# Altium project DC2342A-4.PrjPcb
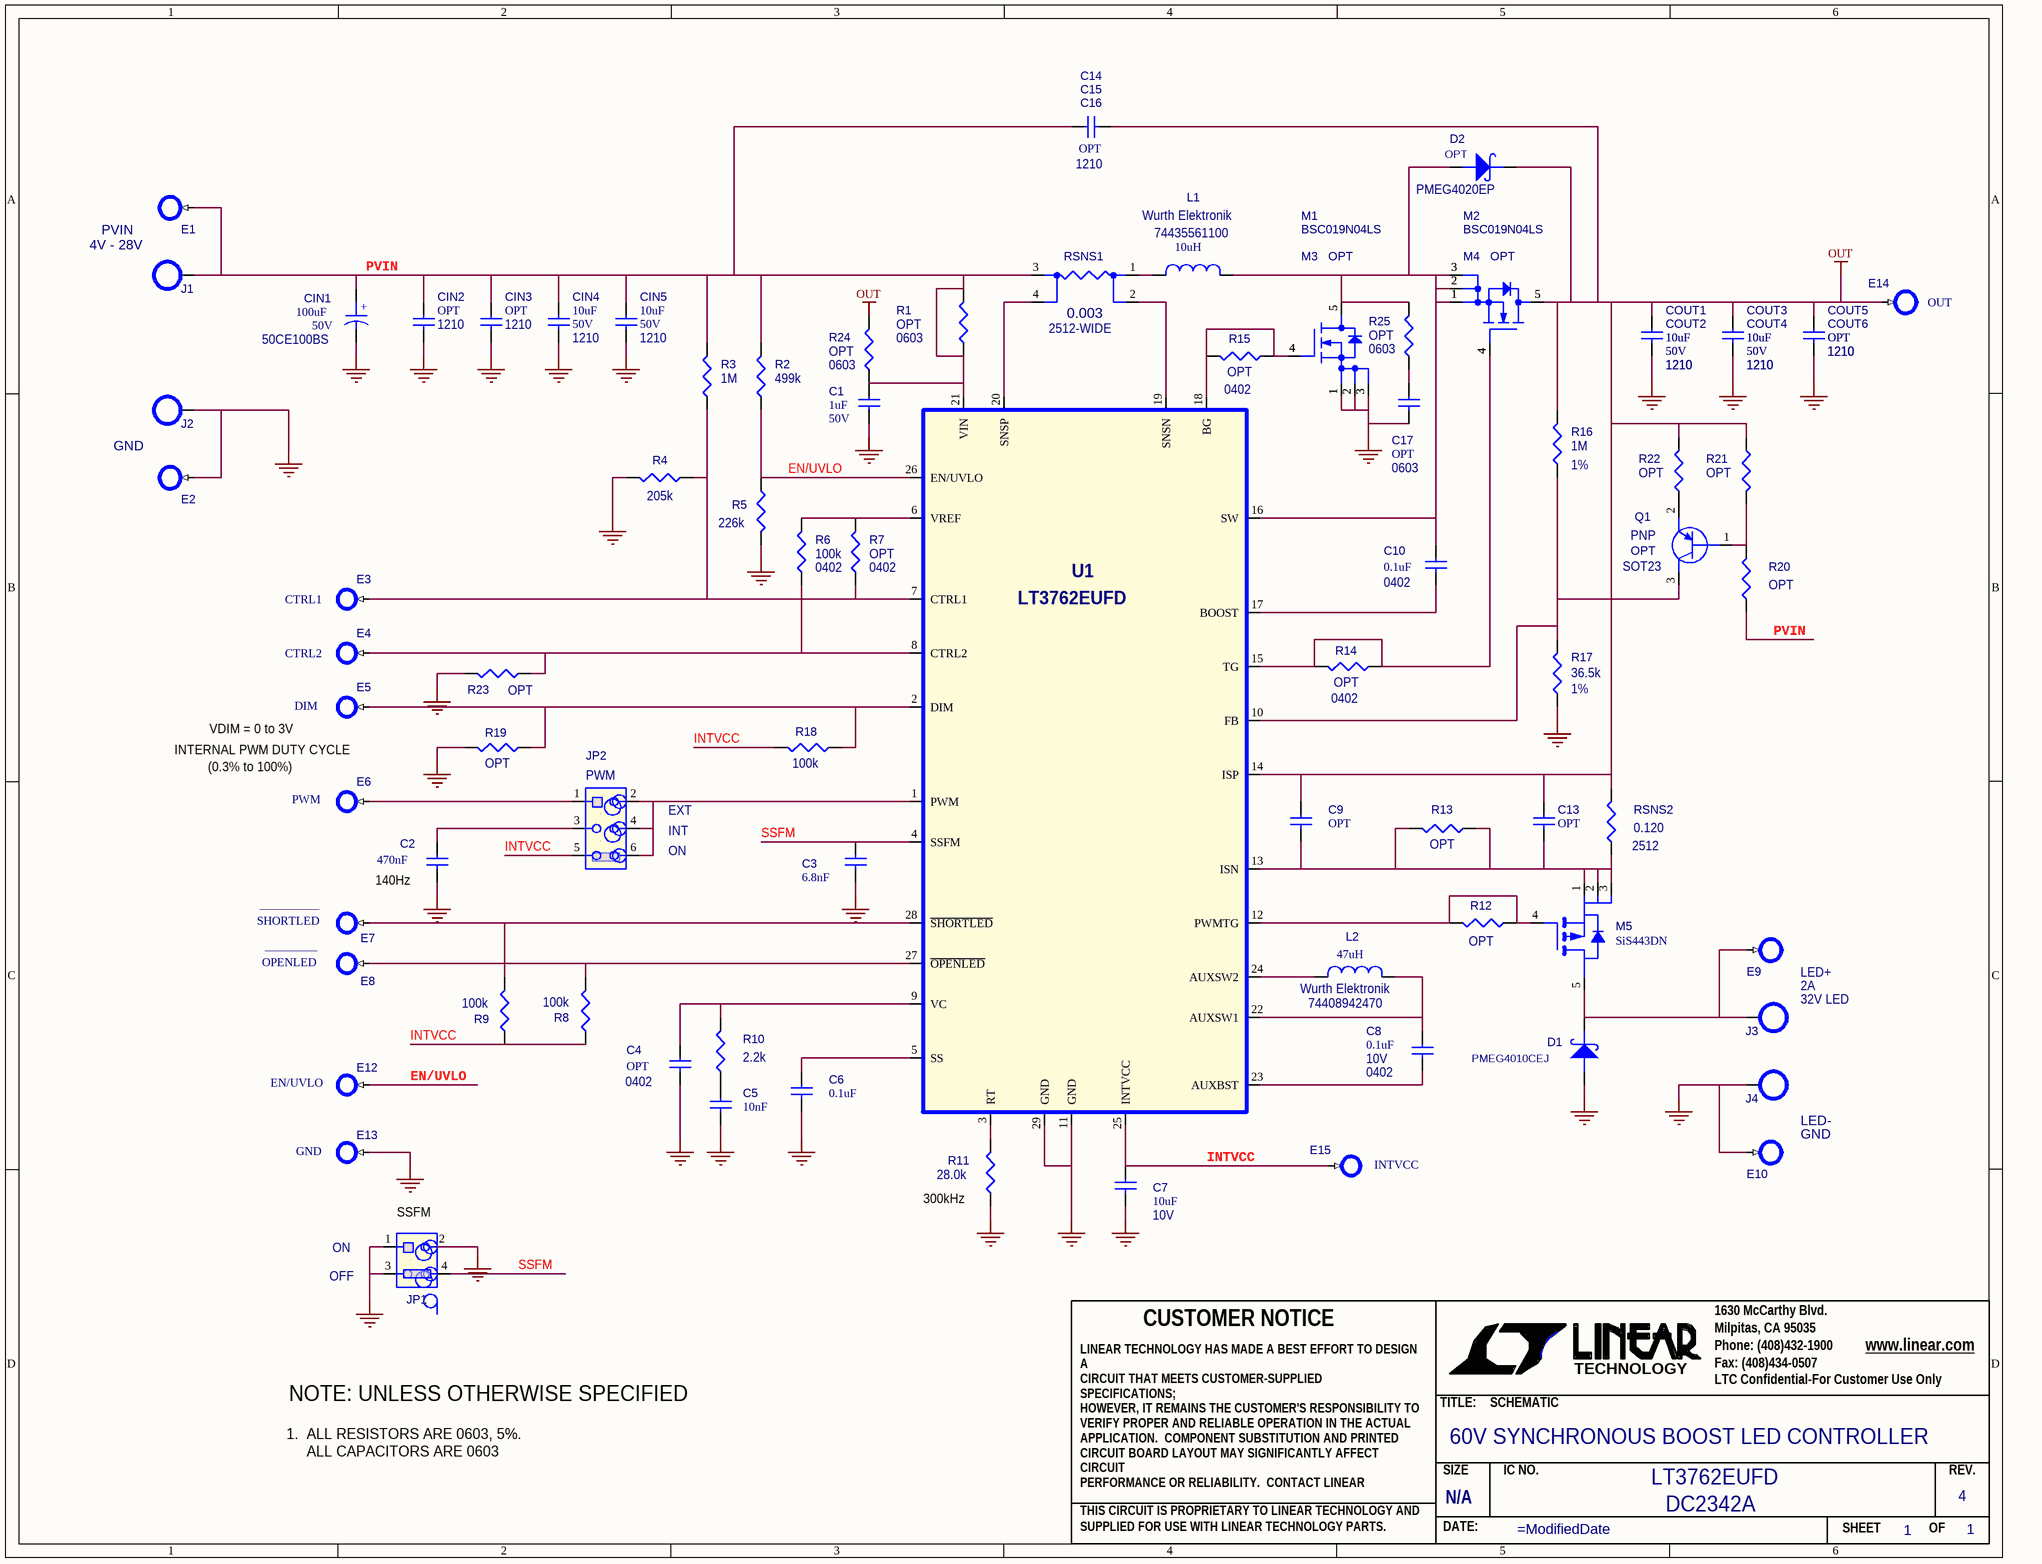
[diagram p0: LT3762EUFD.SchDoc]
1 sheet, 87 parts. Net scope: global (net labels, ports and power ports of the same name join across sheets).

## Sheet LT3762EUFD.SchDoc: 60V SYNCHRONOUS BOOST LED CONTROLLER
size 375 x 292 mm; Date: <DATE>; DATE1: <DATE>; PCB DESIGNER: KIM T.; ECO: 1; Drawn: KIM T.; Page Number: 1; Cage Code: WITH PROGRAMMABLE CURRENT LIMIT; FAB: 1ST PROTOTYPE; APP. ENG.: TIGER Z.; Comment: TITLEBLK-SMALL; Page Count: 1; SIZE: N/A; RevCode: 4; DWG NAME: LT3762EUFD; Doc: DC2342A; DsnPath: D:\Projects\LT3762_Board\DC2342A\DC2342A-4.DSN; SchematicName: DC2342A-4; PageName: LT3762EUFD; PageSize: Custom; TopSchematic: True

### Parts
*  Page Count: 1  Doc: DC2342A  Title: 60V SYNCHRONOUS BOOST LED CONTROLLER  RevCode: 4  DWG NAME: LT3762EUFD  (hidden comment: TITLEBLK-SMALL)  (graphical)
C1  1uF  1st Part Field: 50V  [1206]
C2  470nF  [1206]
C3  6.8nF  [1206]
C4  OPT  PCB Footprint: 0402  [1206]
C5  10nF  [1206]
C6  0.1uF  [1206]
C7  10uF  1st Part Field: 10V  [1206]
C8  0.1uF  1st Part Field: 10V  PCB Footprint: 0402  [1206]
C9  OPT  [1206]
C10  0.1uF  PCB Footprint: 0402  [1206]
C13  OPT  [1206]
C14  OPT  PCB Footprint: 1210  [1206]
C15  OPT  [1206]  (value not drawn)
C16  OPT  [1206]  (value not drawn)
C17  OPT  PCB Footprint: 0603  [1206]
CIN1  100uF  1st Part Field: 50V  5th Part Field: 50CE100BS  [7343\POSCAP]
CIN2  OPT  PCB Footprint: 1210  [1206]
CIN3  OPT  PCB Footprint: 1210  [1206]
CIN4  10uF  1st Part Field: 50V  PCB Footprint: 1210  [1206]
CIN5  10uF  1st Part Field: 50V  PCB Footprint: 1210  [1206]
COUT1  10uF  1st Part Field: 50V  PCB Footprint: 1210  [1206]
COUT2  10uF  1st Part Field: 50V  PCB Footprint: 1210  [1206]
COUT3  10uF  1st Part Field: 50V  PCB Footprint: 1210  [1206]
COUT4  10uF  1st Part Field: 50V  PCB Footprint: 1210  [1206]
COUT5  OPT  PCB Footprint: 1210  [1206]
COUT6  OPT  PCB Footprint: 1210  [1206]
D1  PMEG4010CEJ  [SOD-123]
D2  OPT  5th Part Field: PMEG4020EP  [SOD-123]
E1  Testpoint  [MM/2501]  (value not drawn)
E2  Testpoint  [MM/2501]  (value not drawn)
E3  9th Part Field: CTRL1  [MM/2501]  (hidden comment: Testpoint)
E4  9th Part Field: CTRL2  [MM/2501]  (hidden comment: Testpoint)
E5  9th Part Field: DIM  [MM/2501]  (hidden comment: Testpoint)
E6  9th Part Field: PWM  [MM/2501]  (hidden comment: Testpoint)
E7  10th Part Field: ________  9th Part Field: SHORTLED  [MM/2501]  (hidden comment: Testpoint)
E8  10th Part Field: _______  9th Part Field: OPENLED  [MM/2501]  (hidden comment: Testpoint)
E9  Testpoint  [MM/2501]  (value not drawn)
E10  Testpoint  [MM/2501]  (value not drawn)
E12  9th Part Field: EN/UVLO  [MM/2501]  (hidden comment: Testpoint)
E13  9th Part Field: GND  [MM/2501]  (hidden comment: Testpoint)
E14  9th Part Field: OUT  [MM/2501]  (hidden comment: Testpoint)
E15  9th Part Field: INTVCC  [MM/2501]  (hidden comment: Testpoint)
J1  8th Part Field: 4V - 28V  9th Part Field: PVIN  [KEY-575-4]  (hidden comment: BANANA-JACK)
J2  9th Part Field: GND  [KEY-575-4]  (hidden comment: BANANA-JACK)
J3  9th Part Field: 2A  8th Part Field: LED+  10th Part Field: 32V LED  [KEY-575-4]  (hidden comment: BANANA-JACK)
J4  9th Part Field: LED-  8th Part Field: GND  [KEY-575-4]  (hidden comment: BANANA-JACK)
JP1  9th Part Field: ON  10th Part Field: OFF  [JP2X2/079]  (hidden comment: JP2X2/079)
JP2  9th Part Field: PWM  10th Part Field: ON  13tht Part Field: EXT  11th Part Field: INT  [JP2X3/079]  (hidden comment: JP2X3/079)
L1  10uH  5TH PART FIELD: 74435561100  4TH PART FIELD: Wurth Elektronik  [IND-7443557]
L2  47uH  5TH PART FIELD: 74408942470  4TH PART FIELD: Wurth Elektronik  [IND-7440894]
M1  BSC019N04LS  [PG-TDSON-8]
M2  BSC019N04LS  [PG-TDSON-8]
M3  OPT  [PG-TDSON-8]
M4  OPT  [PG-TDSON-8]
M5  SiS443DN  [SO-08]
Q1  OPT  5TH PART FIELD: PNP  [SOT23]
R1  OPT  PCB Footprint: 0603  [0402]
R2  499k  [0402]
R3  1M  [0402]
R4  205k  [0402]
R5  226k  [0402]
R6  100k  [0402]
R7  OPT  [0402]
R8  100k  [0402]
R9  100k  [0402]
R10  2.2k  [0402]
R11  28.0k  [0402]
R12  OPT  [0402]
R13  OPT  [0402]
R14  OPT  [0402]
R15  OPT  [0402]
R16  1M  6th Part Field: 1%  [0402]
R17  36.5k  6th Part Field: 1%  [0402]
R18  100k  [0402]
R19  OPT  [0402]
R20  OPT  [0402]
R21  OPT  [0402]
R22  OPT  [0402]
R23  OPT  [0402]
R24  OPT  PCB Footprint: 0603  [0402]
R25  OPT  PCB Footprint: 0603  [0402]
RSNS1  0.003  FOOTPRINT: 2512-WIDE  [1206-SENSE]
RSNS2  0.120  PCB Footprint: 2512  [0402]
U1  LT3762EUFD  [QFN-28-4X5]
XJP1  2mm Ctrs.  (value not drawn)
XJP2  2mm Ctrs.  (value not drawn)

### Nets
GND: C1.2 C2.2 C3.2 C4.2 C5.2 C6.2 C7.2 C17.2 CIN1.2 CIN2.2 CIN3.2 CIN4.2 CIN5.2 COUT1.2 COUT2.2 COUT3.2 COUT4.2 COUT5.2 COUT6.2 D1.2 E2.1 E10.1 E13.1 J2.1 J4.1 JP1.1 JP1.2 JP1.3 M1.1(SOURCE) M1.2(SOURCE) M1.3(SOURCE) M3.1(SOURCE) M3.2(SOURCE) M3.3(SOURCE) R4.2 R5.1 R11.1 R17.1 R19.1 R23.1 U1.11(GND) U1.29(GND)
OUT: C9.1 C13.1 C14.2 C15.2 C16.2 COUT1.1 COUT2.1 COUT3.1 COUT4.1 COUT5.1 COUT6.1 D2.1 E14.1 M2.5(DRAIN) M4.5(DRAIN) R16.2 R21.1 R22.2 R24.2 RSNS2.2 U1.14(ISP)
EN/UVLO: E12.1 R2.1 R5.2 U1.26(EN/UVLO)
INTVCC: C7.1 E15.1 JP2.5 R8.2 R9.2 R18.1 U1.25(INTVCC)
PVIN: C1.1 C14.1 C15.1 C16.1 CIN1.1 CIN2.1 CIN3.1 CIN4.1 CIN5.1 E1.1 J1.1 R1.1 R1.2 R2.2 R3.2 R20.1 R24.1 RSNS1.3 U1.21(VIN)
SSFM: C3.1 JP1.4 U1.4(SSFM)
NetC2_1: C2.1 JP2.3
NetC4_1: C4.1 R10.2 U1.9(VC)
NetC5_1: C5.1 R10.1
NetC6_1: C6.1 U1.5(SS)
NetC8_1: C8.1 L2.2 U1.22(AUXSW1)
NetC8_2: C8.2 U1.23(AUXBST)
NetC9_2: C9.2 C13.2 M5.1 M5.2 M5.3 R13.1 R13.2 RSNS2.1 U1.13(ISN)
NetC10_1: C10.1 D2.2 L1.2 M1.5(DRAIN) M2.1(SOURCE) M2.2(SOURCE) M2.3(SOURCE) M3.5(DRAIN) M4.1(SOURCE) M4.2(SOURCE) M4.3(SOURCE) R25.2 U1.16(SW)
NetC10_2: C10.2 U1.17(BOOST)
NetC17_1: C17.1 R25.1
NetD1_1: D1.1 E9.1 J3.1 M5.5
NetE3_1: E3.1 R3.1 R4.1 R7.1 U1.7(CTRL1)
NetE4_1: E4.1 R6.1 R23.2 U1.8(CTRL2)
NetE5_1: E5.1 R18.2 R19.2 U1.2(DIM)
NetE6_1: E6.1 JP2.1
NetE7_1: E7.1 R9.1 U1.28(~{SHORTLED})
NetE8_1: E8.1 R8.1 U1.27(~{OPENLED})
NetJP2_2: JP2.2 JP2.4 JP2.6 U1.1(PWM)
NetL1_1: L1.1 RSNS1.1
NetL2_1: L2.1 U1.24(AUXSW2)
NetM1_4: M1.4(GATE) M3.4(GATE) R15.1 R15.2 U1.18(BG)
NetM2_4: M2.4(GATE) M4.4(GATE) R14.1 R14.2 U1.15(TG)
NetM5_4: M5.4 R12.1 R12.2 U1.12(PWMTG)
NetQ1_1: Q1.1(B) R20.2 R21.2
NetQ1_2: Q1.2(E) R22.1
NetQ1_3: Q1.3(C) R16.1 R17.2 U1.10(FB)
NetR6_2: R6.2 R7.2 U1.6(VREF)
NetR11_2: R11.2 U1.3(RT)
NetRSNS1_2: RSNS1.2 U1.19(SNSN)
NetRSNS1_4: RSNS1.4 U1.20(SNSP)

### Notes on the sheet
- INTERNAL PWM DUTY CYCLE
- (0.3% to 100%)
- VDIM = 0 to 3V
- 140Hz
- (near JP1) SSFM
- (near R11) 300kHz
- 1.  ALL RESISTORS ARE 0603, 5%.
  ALL CAPACITORS ARE 0603
- NOTE: UNLESS OTHERWISE SPECIFIED
- (in symbol 16TQC47M) +
- (in symbol TITLEBLK-SMALL) 1630 McCarthy Blvd.; CUSTOMER NOTICE; Milpitas, CA 95035; Phone: (408)432-1900; www.linear.com; Fax: (408)434-0507; TECHNOLOGY; LTC Confidential-For Customer Use Only; TITLE:; SCHEMATIC; SIZE; IC NO.; REV.; LINEAR TECHNOLOGY HAS MADE A BEST EFFORT TO DESIGN A / CIRCUIT THAT MEETS CUSTOMER-SUPPLIED SPECIFICATIONS; / HOWEVER, IT REMAINS THE CUSTOMER'S RESPONSIBILITY TO / VERIFY PROPER AND RELIABLE OPERATION IN THE ACTUAL / APPLICATION.  COMPONENT SUBSTITUTION AND PRINTED / CIRCUIT BOARD LAYOUT MAY SIGNIFICANTLY AFFECT CIRCUIT / PERFORMANCE OR RELIABILITY.  CONTACT LINEAR / TECHNOLOGY APPLICATIONS ENGINEERING FOR ASSISTANCE.; THIS CIRCUIT IS PROPRIETARY TO LINEAR TECHNOLOGY AND; SUPPLIED FOR USE WITH LINEAR TECHNOLOGY PARTS.; DATE:; SHEET; OF

### Library data of the parts
* = TITLEBLK-SMALL: FAB: 1ST PROTOTYPE; APP. ENG.: TIGER Z.; PCB DESIGNER: KIM T.; DATE1: <DATE>; Cage Code: WITH PROGRAMMABLE CURRENT LIMIT; ECO: 1; SIZE: N/A; Drawn: KIM T.; Page Number: 1; DATE: <DATE>; Page Modify Date: =ModifiedDate
C1 = GRM31CR61H225KA88K: 7th Part Field: CAP.,; 3rd Part Field: X5R; 5th Part Field: GRM188R61H105KAALD; 4th Part Field: Murata; 2nd Part Field: 10%; Part Reference: C1; PCB Footprint: 0603; Value: 1uF
C2 = GRM31CR61H225KA88K: 7th Part Field: CAP.,; 1st Part Field: 25V; 3rd Part Field: X5R; 5th Part Field: GRM188R71E474KA12D; 4th Part Field: Murata; 2nd Part Field: 10%; Part Reference: C2; PCB Footprint: 0603; Value: 470nF
C3 = GRM31CR61H225KA88K: 7th Part Field: CAP.,; 1st Part Field: 50V; 3rd Part Field: X5R; 5th Part Field: GRM188R71H682KA01D; 4th Part Field: Murata; 2nd Part Field: 10%; Part Reference: C3; PCB Footprint: 0603; Value: 6.8nF
C4 = GRM31CR61H225KA88K: 7th Part Field: CAP.,; 2nd Part Field: 10%; Part Reference: C4; Value: OPT
C5 = GRM31CR61H225KA88K: 7th Part Field: CAP.,; 1st Part Field: 25V; 3rd Part Field: X7R; 5th Part Field: GRM188R71E103KA01D; 4th Part Field: Murata; 2nd Part Field: 10%; Part Reference: C5; PCB Footprint: 0603; Value: 10nF
C6 = GRM31CR61H225KA88K: 7th Part Field: CAP.,; 1st Part Field: 10V; 3rd Part Field: X7R; 5th Part Field: 0603ZC104KAT2A; 4th Part Field: AVX; 2nd Part Field: 10%; Part Reference: C6; PCB Footprint: 0603; Value: 0.1uF
C7 = GRM31CR61H225KA88K: 7th Part Field: CAP.,; 3rd Part Field: X5R; 5th Part Field: C1608X5R1A106K080AC; 4th Part Field: TDK; 2nd Part Field: 10%; Part Reference: C7; PCB Footprint: 0603; Value: 10uF
C8 = GRM31CR61H225KA88K: 7th Part Field: CAP.,; 3rd Part Field: X7R; 5th Part Field: GRM155R71A104KA01D; 4th Part Field: Murata; 2nd Part Field: 10%; Part Reference: C8; Value: 0.1uF
C9 = GRM31CR61H225KA88K: 7th Part Field: CAP.,; 2nd Part Field: 10%; Part Reference: C9; PCB Footprint: 0603; Value: OPT
C10 = GRM31CR61H225KA88K: 7th Part Field: CAP.,; 1st Part Field: 10V; 3rd Part Field: X7R; 5th Part Field: GRM155R71A104KA01D; 4th Part Field: Murata; 2nd Part Field: 10%; Part Reference: C10; Value: 0.1uF
C13 = GRM31CR61H225KA88K: 7th Part Field: CAP.,; 2nd Part Field: 10%; Part Reference: C13; PCB Footprint: 0603; Value: OPT
C14 = GRM31CR61H225KA88K: 7th Part Field: CAP.,; 2nd Part Field: 10%; Part Reference: C14; Value: OPT
C15 = GRM31CR61H225KA88K: 7th Part Field: CAP.,; 2nd Part Field: 10%; Part Reference: C15; PCB Footprint: 1210; Value: OPT
C16 = GRM31CR61H225KA88K: 7th Part Field: CAP.,; 2nd Part Field: 10%; Part Reference: C16; PCB Footprint: 1210; Value: OPT
C17 = GRM31CR61H225KA88K: 7th Part Field: CAP.,; 2nd Part Field: 10%; Part Reference: C17; Value: OPT
CIN1 = 16TQC47M: 2nd Part Field: 20%; 7th Part Field: CAP.,; 4th Part Field: SUN ELEC.; 3rd Part Field: ALUM; Part Reference: CIN1; PCB Footprint: CAP-ALUM-8mm; Value: 100uF
CIN2 = GRM31CR61H225KA88K: 7th Part Field: CAP.,; 2nd Part Field: 10%; Part Reference: CIN2; Value: OPT
CIN3 = GRM31CR61H225KA88K: 7th Part Field: CAP.,; 2nd Part Field: 10%; Part Reference: CIN3; Value: OPT
CIN4 = GRM31CR61H225KA88K: 7th Part Field: CAP.,; 3rd Part Field: X7R; 5th Part Field: GRM32ER71H106KA12L; 4th Part Field: MURATA; 2nd Part Field: 10%; Part Reference: CIN4; Value: 10uF
CIN5 = GRM31CR61H225KA88K: 7th Part Field: CAP.,; 3rd Part Field: X7R; 5th Part Field: GRM32ER71H106KA12L; 4th Part Field: MURATA; 2nd Part Field: 10%; Part Reference: CIN5; Value: 10uF
COUT1 = GRM31CR61H225KA88K: 7th Part Field: CAP.,; 3rd Part Field: X7R; 5th Part Field: GRM32ER71H106KA12L; 4th Part Field: MURATA; 2nd Part Field: 10%; Part Reference: COUT1; Value: 10uF
COUT2 = GRM31CR61H225KA88K: 7th Part Field: CAP.,; 3rd Part Field: X7R; 5th Part Field: GRM32ER71H106KA12L; 4th Part Field: MURATA; 2nd Part Field: 10%; Part Reference: COUT2; Value: 10uF
COUT3 = GRM31CR61H225KA88K: 7th Part Field: CAP.,; 3rd Part Field: X7R; 5th Part Field: GRM32ER71H106KA12L; 4th Part Field: MURATA; 2nd Part Field: 10%; Part Reference: COUT3; Value: 10uF
COUT4 = GRM31CR61H225KA88K: 7th Part Field: CAP.,; 3rd Part Field: X7R; 5th Part Field: GRM32ER71H106KA12L; 4th Part Field: MURATA; 2nd Part Field: 10%; Part Reference: COUT4; Value: 10uF
COUT5 = GRM31CR61H225KA88K: 7th Part Field: CAP.,; 2nd Part Field: 10%; Part Reference: COUT5; Value: OPT
COUT6 = GRM31CR61H225KA88K: 7th Part Field: CAP.,; 2nd Part Field: 10%; Part Reference: COUT6; Value: OPT
D1 = DIODE-SCHOTTKY_0: Part Reference: D1; PCB Footprint: SOD-323F; Value: PMEG4010CEJ
D2 = DIODE-SCHOTTKY_0: 4th Part Field: NEXPERIA; Part Reference: D2; PCB Footprint: SOD-128; Value: OPT
E1 = MillMax-2501_0: 5th Part Field: 2501-2; 7th Part Field: Turret,; Part Reference: E1; 10th Part Field: -1.5V TO -36V; 9th Part Field: VIN; VALUE1: AAA; PCB Footprint: PAD150-094; 4th Part Field: Mill Max; Value: Testpoint
E2 = MillMax-2501_0: 5th Part Field: 2501-2; 7th Part Field: Turret,; Part Reference: E2; 9th Part Field: VIN; 10th Part Field: -1.5V TO -36V; VALUE1: AAA; PCB Footprint: PAD150-094; 4th Part Field: Mill Max; Value: Testpoint
E3 = MillMax-2501_3: 7th Part Field: Turret,; 5th Part Field: 2501-2; Part Reference: E3; 10th Part Field: -1.5V TO -36V; VALUE1: AAA; PCB Footprint: MM/2308; 4th Part Field: Mill Max; Value: Testpoint
E4 = MillMax-2501_3: 7th Part Field: Turret,; 5th Part Field: 2501-2; Part Reference: E4; 10th Part Field: -1.5V TO -36V; VALUE1: AAA; PCB Footprint: MM/2308; 4th Part Field: Mill Max; Value: Testpoint
E5 = MillMax-2501_3: 7th Part Field: Turret,; 5th Part Field: 2501-2; Part Reference: E5; 10th Part Field: 0 TO 3V; VALUE1: AAA; PCB Footprint: MM/2308; 4th Part Field: Mill Max; Value: Testpoint
E6 = MillMax-2501_3: 7th Part Field: Turret,; 5th Part Field: 2501-2; Part Reference: E6; 10th Part Field: 0 TO 3V; VALUE1: AAA; PCB Footprint: MM/2308; 4th Part Field: Mill Max; Value: Testpoint
E7 = MillMax-2501_3: 7th Part Field: Turret,; 5th Part Field: 2501-2; Part Reference: E7; VALUE1: AAA; PCB Footprint: MM/2308; 4th Part Field: Mill Max; Value: Testpoint
E8 = MillMax-2501_3: 7th Part Field: Turret,; 5th Part Field: 2501-2; Part Reference: E8; VALUE1: AAA; PCB Footprint: MM/2308; 4th Part Field: Mill Max; Value: Testpoint
E9 = MillMax-2501_0: 5th Part Field: 2501-2; 7th Part Field: Turret,; Part Reference: E9; 10th Part Field: -1.5V TO -36V; 9th Part Field: VIN; VALUE1: AAA; PCB Footprint: PAD150-094; 4th Part Field: Mill Max; Value: Testpoint
E10 = MillMax-2501_0: 5th Part Field: 2501-2; 7th Part Field: Turret,; Part Reference: E10; 9th Part Field: VIN; 10th Part Field: -1.5V TO -36V; VALUE1: AAA; PCB Footprint: PAD150-094; 4th Part Field: Mill Max; Value: Testpoint
E12 = MillMax-2501_3: 7th Part Field: Turret,; 5th Part Field: 2501-2; Part Reference: E12; 10th Part Field: -1.5V TO -36V; VALUE1: AAA; PCB Footprint: MM/2308; 4th Part Field: Mill Max; Value: Testpoint
E13 = MillMax-2501_3: 7th Part Field: Turret,; 5th Part Field: 2501-2; Part Reference: E13; 10th Part Field: -1.5V TO -36V; VALUE1: AAA; PCB Footprint: MM/2308; 4th Part Field: Mill Max; Value: Testpoint
E14 = MillMax-2501_0: 5th Part Field: 2501-2; 7th Part Field: Turret,; Part Reference: E14; 10th Part Field: -1.5V TO -36V; VALUE1: AAA; PCB Footprint: PAD150-094; 4th Part Field: Mill Max; Value: Testpoint
E15 = MillMax-2501_3: 7th Part Field: Turret,; 5th Part Field: 2501-2; Part Reference: E15; 10th Part Field: -1.5V TO -36V; VALUE1: AAA; PCB Footprint: MM/2308; 4th Part Field: Mill Max; Value: Testpoint
J1 = BANANA-JACK: Part Reference: J1; Value: BANANA-JACK; PCB Footprint: KEY-575-4
J2 = BANANA-JACK: Part Reference: J2; 8th Part Field: 6V - 50V; Value: BANANA-JACK; PCB Footprint: KEY-575-4
J3 = BANANA-JACK: Part Reference: J3; Value: BANANA-JACK; PCB Footprint: KEY-575-4
J4 = BANANA-JACK: Part Reference: J4; Value: BANANA-JACK; PCB Footprint: KEY-575-4
JP1 = JP2X2/079_1: 4TH PART FIELD: WURTH ELEKTRONIK; 5TH PART FIELD: 62000421121; 7 TH PART FIELD: 0.079 DOUBLE ROW HEADER; Part Reference: JP1; PCB Footprint: JP2X2/079
JP2 = JP2X3/079: 7 TH PART FIELD: 0.079 DOUBLE ROW HEADER; 5TH PART FIELD: 62000621121; 4TH PART FIELD: WURTH ELEKTRONIK; Part Reference: JP2; PCB Footprint: JP2X3/079
L1 = IND: 7TH PART FIELD: INDUCTOR,; Part Reference: L1; Value: 10uH; PCB Footprint: IND-7443557
L2 = IND: 7TH PART FIELD: INDUCTOR,; Part Reference: L2; Value: 47uH; PCB Footprint: IND-7440894
M1 = 2N7000_6: Part Reference: M1; Value: BSC019N04LS; PCB Footprint: PG-TDSON-8
M2 = 2N7000_6: Part Reference: M2; Value: BSC019N04LS; PCB Footprint: PG-TDSON-8
M3 = 2N7000_6: Part Reference: M3; Value: OPT; PCB Footprint: PG-TDSON-8
M4 = 2N7000_6: Part Reference: M4; Value: OPT; PCB Footprint: PG-TDSON-8
M5 = SI4463BDY_1: 7TH PART FIELD: P-MOSFET; 4TH PART FIELD: VISHAY; Part Reference: M5; PCB Footprint: POWERPAK-1212-8-S-5P; 5TH PART FIELD: Si4463BDY; Value: SiS443DN
Q1 = PNP_0: 4TH PART FIELD: MF; 7TH PART FIELD: TRANSISTOR,; Part Reference: Q1; 2ND PART FIELD: SOT23; Value: OPT; PCB Footprint: SOT23
R1 = RES0402: 7th Part Field: Res.,; Part Reference: R1; 3rd Part Field: 0603; Value: OPT
R2 = RES0402: 7th Part Field: Res.,; 3rd Part Field: 0603; Part Reference: R2; Value: 499k; PCB Footprint: 0603
R3 = RES0402: 7th Part Field: Res.,; 3rd Part Field: 0603; Part Reference: R3; Value: 1M; PCB Footprint: 0603
R4 = RES0402: 7th Part Field: Res.,; 3rd Part Field: 0603; Part Reference: R4; Value: 205k; PCB Footprint: 0603
R5 = RES0402: 7th Part Field: Res.,; 3rd Part Field: 0603; Part Reference: R5; Value: 226k; PCB Footprint: 0603
R6 = RES0402: 7th Part Field: Res.,; 3rd Part Field: 0603; Part Reference: R6; Value: 100k; PCB Footprint: 0402
R7 = RES0402: 7th Part Field: Res.,; Part Reference: R7; 3rd Part Field: 0402; Value: OPT; PCB Footprint: 0402
R8 = RES0402: 7th Part Field: Res.,; 3rd Part Field: 0603; Part Reference: R8; Value: 100k; PCB Footprint: 0603
R9 = RES0402: 7th Part Field: Res.,; 3rd Part Field: 0603; Part Reference: R9; Value: 100k; PCB Footprint: 0603
R10 = RES0402: 7th Part Field: Res.,; 3rd Part Field: 0603; Part Reference: R10; Value: 2.2k; PCB Footprint: 0603
R11 = RES0402: 7th Part Field: Res.,; 3rd Part Field: 0603; Part Reference: R11; Value: 28.0k; PCB Footprint: 0603
R12 = RES0402: 7th Part Field: Res.,; 3rd Part Field: 0603; Part Reference: R12; Value: OPT; PCB Footprint: 0603
R13 = RES0402: 7th Part Field: Res.,; 3rd Part Field: 0603; Part Reference: R13; Value: OPT; PCB Footprint: 0603
R14 = RES0402: 7th Part Field: Res.,; Part Reference: R14; 3rd Part Field: 0402; Value: OPT; PCB Footprint: 0402
R15 = RES0402: 7th Part Field: Res.,; Part Reference: R15; 3rd Part Field: 0402; Value: OPT; PCB Footprint: 0402
R16 = RES0402: 7th Part Field: Res.,; 3rd Part Field: 0603; Part Reference: R16; Value: 1M; PCB Footprint: 0603
R17 = RES0402: 7th Part Field: Res.,; 3rd Part Field: 0603; Part Reference: R17; Value: 36.5k; PCB Footprint: 0603
R18 = RES0402: 7th Part Field: Res.,; 3rd Part Field: 0603; Part Reference: R18; Value: 100k; PCB Footprint: 0603
R19 = RES0402: 7th Part Field: Res.,; 3rd Part Field: 0603; Part Reference: R19; Value: OPT; PCB Footprint: 0603
R20 = RES0402: 7th Part Field: Res.,; 3rd Part Field: 0603; Part Reference: R20; Value: OPT; PCB Footprint: 0603
R21 = RES0402: 7th Part Field: Res.,; 3rd Part Field: 0603; Part Reference: R21; Value: OPT; PCB Footprint: 0603
R22 = RES0402: 7th Part Field: Res.,; 3rd Part Field: 0603; Part Reference: R22; Value: OPT; PCB Footprint: 0603
R23 = RES0402: 7th Part Field: Res.,; 3rd Part Field: 0603; Part Reference: R23; Value: OPT; PCB Footprint: 0603
R24 = RES0402: 7th Part Field: Res.,; Part Reference: R24; 3rd Part Field: 0603; Value: OPT
R25 = RES0402: 7th Part Field: Res.,; Part Reference: R25; 3rd Part Field: 0603; Value: OPT
RSNS1 = LRC1206-SENSE_0: 7th Part Field: Resistor,; Part Reference: RSNS1; PCB Footprint: 1225-4PIN; Value: 0.003
RSNS2 = RES0402: 7th Part Field: Res.,; Part Reference: RSNS2; 3rd Part Field: 2512; Value: 0.120
U1 = LT3932EFE_37: Part Reference: U1; Value: LT3762EUFD; PCB Footprint: QFN-28-4X5
XJP1 = Samtec\2SN-BK-G_1: 4th Part Field: WURTH ELEKTRONIK; 5th Part Field: 60800213421; 7th Part Field: Shunt,; Part Reference: XJP1; Value: 2mm Ctrs.
XJP2 = Samtec\2SN-BK-G_2: 7th Part Field: Shunt,; 5th Part Field: 60800213421; 4th Part Field: WURTH ELEKTRONIK; Part Reference: XJP2; Value: 2mm Ctrs.